# EAGLE design Node_Board (EAGLE 8.6.3)
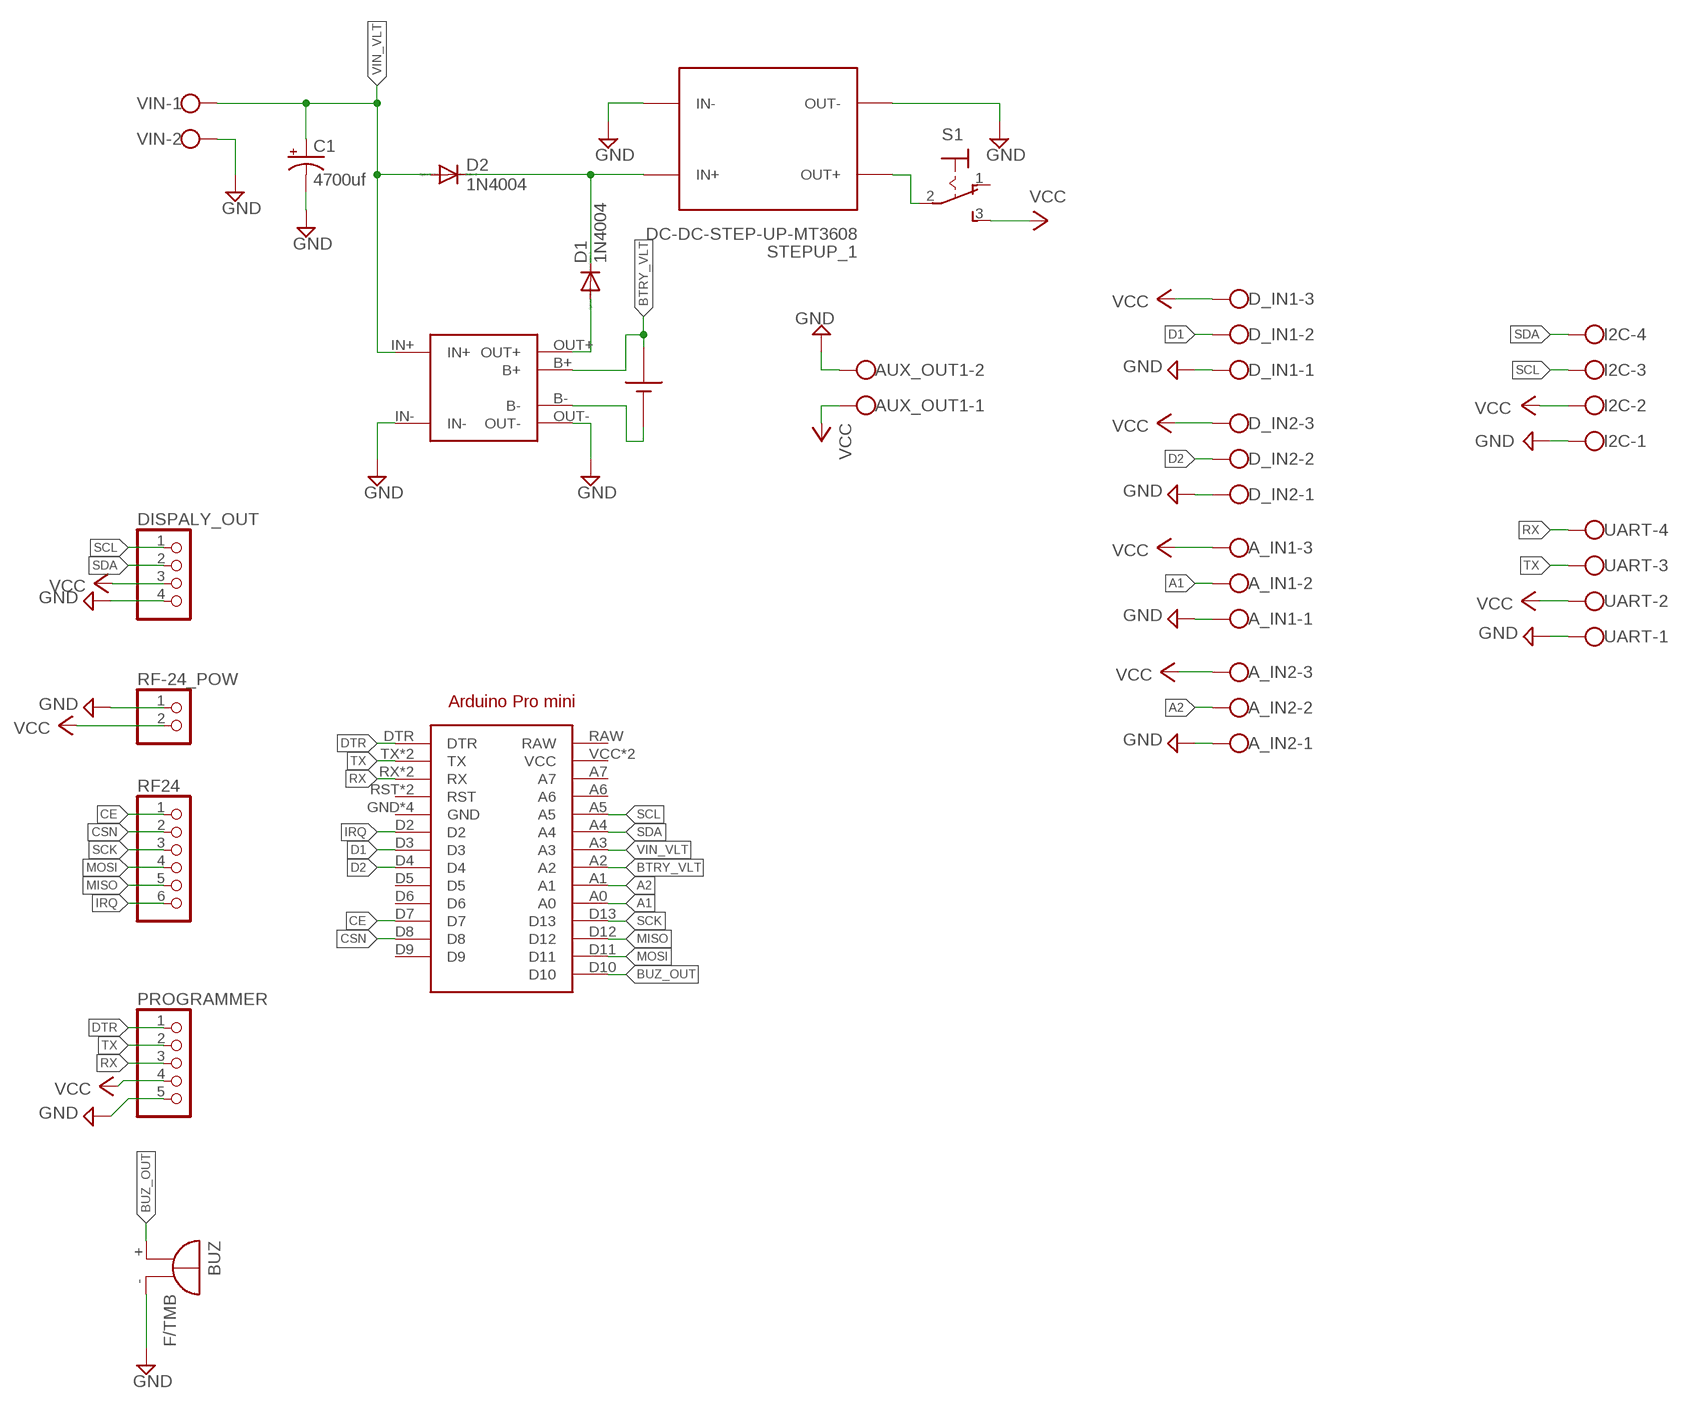
[diagram p0: schematic, sheet 1]

## Parts
A_IN1  W237-103  [W237-103]
A_IN2  W237-103  [W237-103]
ARDUINO1  ARDUINO_PRO_MINI  [ARDUINO_PRO_MINI]
AUX_OUT1  W237-102  [W237-102]
BATTRY  18650CABLE  [18650-CASE-CABLE]
BUZ  F/TMB  [F/TMB]
C1  4700uf  CPOL-USE3.5-8  [E3,5-8]
D1  1N4004  [DO41-10]
D2  1N4004  [DO41-10]
D_IN1  W237-103  [W237-103]
D_IN2  W237-103  [W237-103]
DISPALY_OUT  PINHD-1X4  [1X04]
I2C  W237-4  [W237-4]
PROGRAMMER  PINHD-1X5  [1X05]
RF24  PINHD-1X6  [1X06]
RF-24_POW  PINHD-1X2  [1X02]
S1  M9040P  [M9040P]
STEPUP_1  DC-DC-STEP-UP-MT3608  [DC-DC-STEP-UP-MT3608]
U$2  TP4056-MODULE  [TP4056-LITHIUM-PROTECTED-MODULE]
UART  W237-4  [W237-4]
VIN  W237-102  [W237-102]

## Nets
A1: A_IN1.2 ARDUINO1.A0
A2: A_IN2.2 ARDUINO1.A1
BTRY_VLT: ARDUINO1.A2 BATTRY.POS U$2.B+
BUZ_OUT: ARDUINO1.D10 BUZ.+
CE: ARDUINO1.D7 RF24.1
CSN: ARDUINO1.D8 RF24.2
D1: ARDUINO1.D3 D_IN1.2
D2: ARDUINO1.D4 D_IN2.2
DTR: ARDUINO1.DTR PROGRAMMER.1
GND: A_IN1.1 A_IN2.1 AUX_OUT1.2 BUZ.- C1.- D_IN1.1 D_IN2.1 DISPALY_OUT.4 I2C.1 PROGRAMMER.5 RF-24_POW.1 STEPUP_1.IN- STEPUP_1.OUT- U$2.IN- U$2.OUT- UART.1 VIN.2
IRQ: ARDUINO1.D2 RF24.6
MISO: ARDUINO1.D12 RF24.5
MOSI: ARDUINO1.D11 RF24.4
N$1: D1.C D2.C STEPUP_1.IN+
N$2: BATTRY.NEG U$2.B-
N$3: D1.A U$2.OUT+
N$4: S1.2(P) STEPUP_1.OUT+
RX: ARDUINO1.RX ARDUINO1.RX@1(RX) PROGRAMMER.3 UART.4
SCK: ARDUINO1.D13 RF24.3
SCL: ARDUINO1.A5 DISPALY_OUT.1 I2C.3
SDA: ARDUINO1.A4 DISPALY_OUT.2 I2C.4
TX: ARDUINO1.TX ARDUINO1.TX@1(TX) PROGRAMMER.2 UART.3
VCC: A_IN1.3 A_IN2.3 AUX_OUT1.1 D_IN1.3 D_IN2.3 DISPALY_OUT.3 I2C.2 PROGRAMMER.4 RF-24_POW.2 S1.3(S) UART.2
VIN_VLT: ARDUINO1.A3 C1.+ D2.A U$2.IN+ VIN.1
Unconnected: ARDUINO1.A6 ARDUINO1.A7 ARDUINO1.D5 ARDUINO1.D6 ARDUINO1.D9 ARDUINO1.RAW ARDUINO1.RST ARDUINO1.RST@1(RST) S1.1(O)

## Power pins joined to a net without a drawn wire
GND: ARDUINO1.GND ARDUINO1.GND@1(GND) ARDUINO1.GND@2(GND) ARDUINO1.GND@3(GND)
VCC: ARDUINO1.VCC ARDUINO1.VCC@1(VCC)

## Library data of the parts
A_IN1 A_IN2 D_IN1 D_IN2 = con-wago-500:W237-103: WAGO SCREW CLAMP; MPN: 237-103; OC_FARNELL: unknown; OC_NEWARK: 18M7116
ARDUINO1 = arduinopromini:ARDUINO_PRO_MINI: For creating Arduino Pro Mini shields
AUX_OUT1 VIN = con-wago-500:W237-102: WAGO SCREW CLAMP; MPN: 237-102; OC_FARNELL: unknown; OC_NEWARK: 70K9898
BATTRY = userlib:18650: Lithium Ion 18650
BUZ = buzzer:F/TMB: BUZZER Source: Buerklin; OC_FARNELL: unknown; OC_NEWARK: unknown
C1 = adafruit:CPOL-US: POLARIZED CAPACITOR, American symbol
D1 D2 = diode:1N4004: DIODE general purpose rectifier, 1 A
DISPALY_OUT = pinhead:PINHD-1X4: PIN HEADER
I2C UART = con-wago-500:W237-4: WAGO SCREW CLAMP; OC_FARNELL: unknown; OC_NEWARK: unknown
PROGRAMMER = pinhead:PINHD-1X5: PIN HEADER
RF24 = pinhead:PINHD-1X6: PIN HEADER
RF-24_POW = pinhead:PINHD-1X2: PIN HEADER
S1 = switch:M9040P: TOGGLE SWITCH Marquardt
STEPUP_1 = diy-modules:DC-DC-STEP-UP-MT3608: DC/DC Step-Up Regulator based on MT3608 chip MT3608 datasheet available here: https://www.olimex.com/Products/Breadboarding/BB-PWR-3608/resources/MT3608.pdf Click here to find device on ebay.com <http://www.ebay.com/sch/mt3608+module>
U$2 = userlib:TP4056-MODULE

## Board
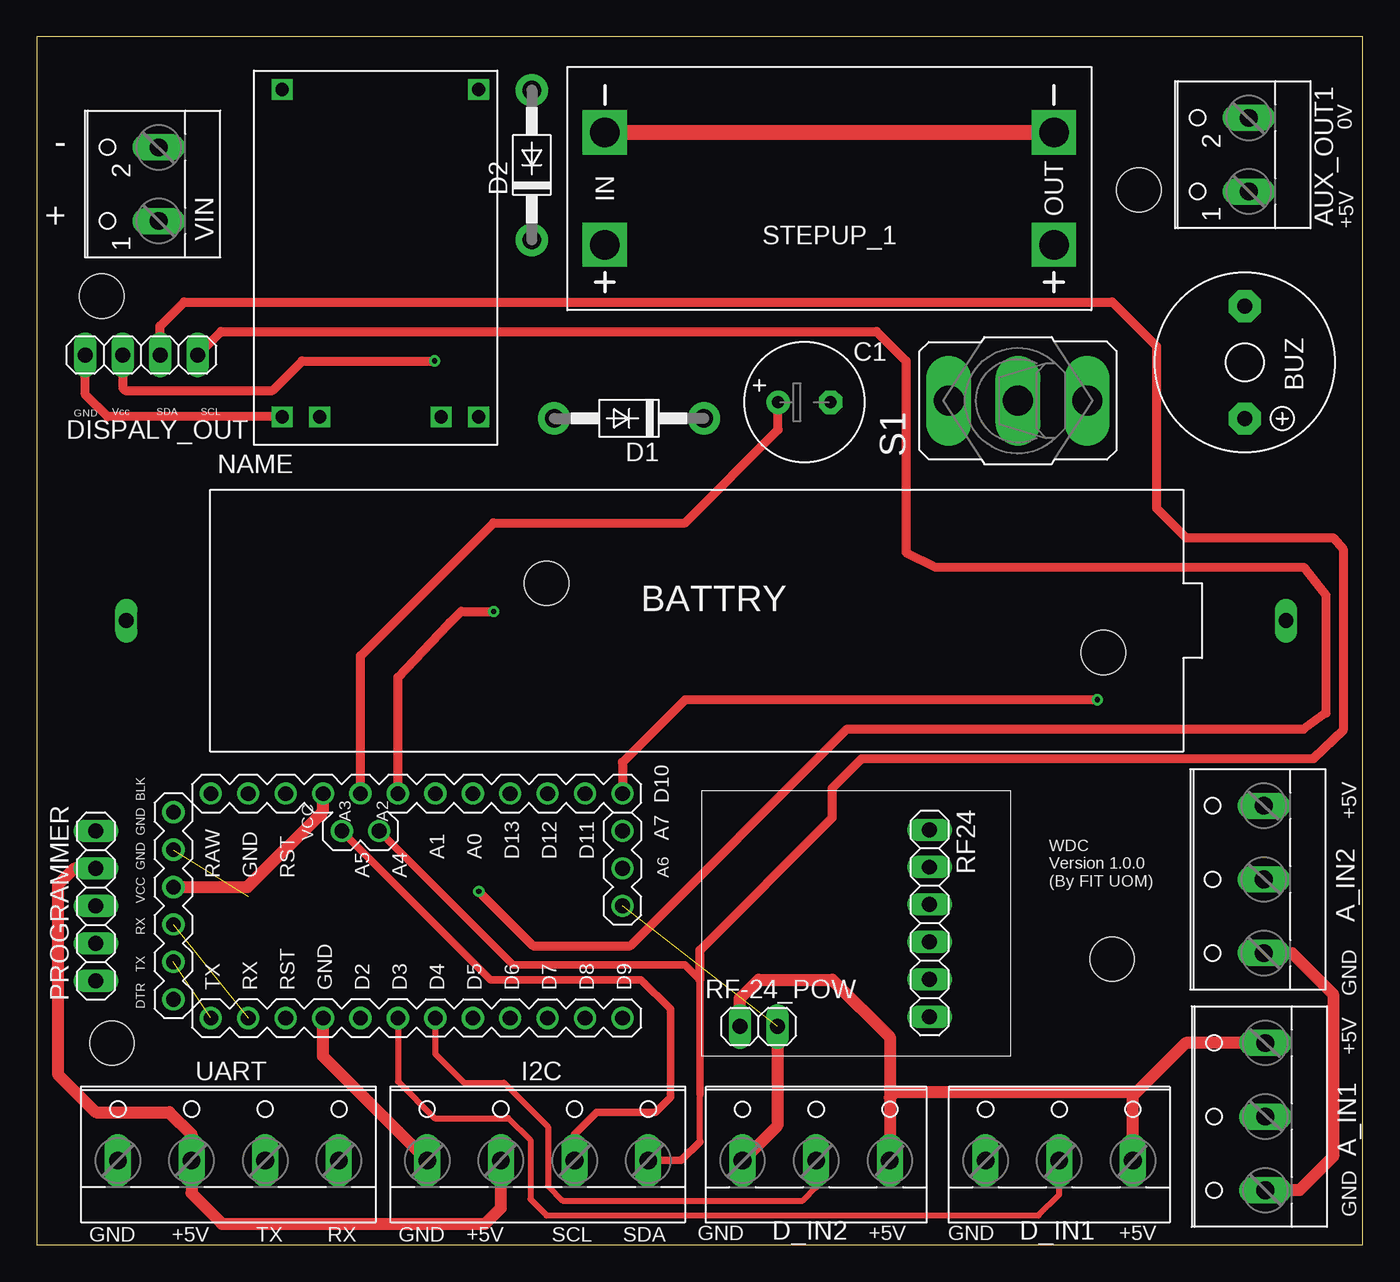
[diagram p1: board, top side]
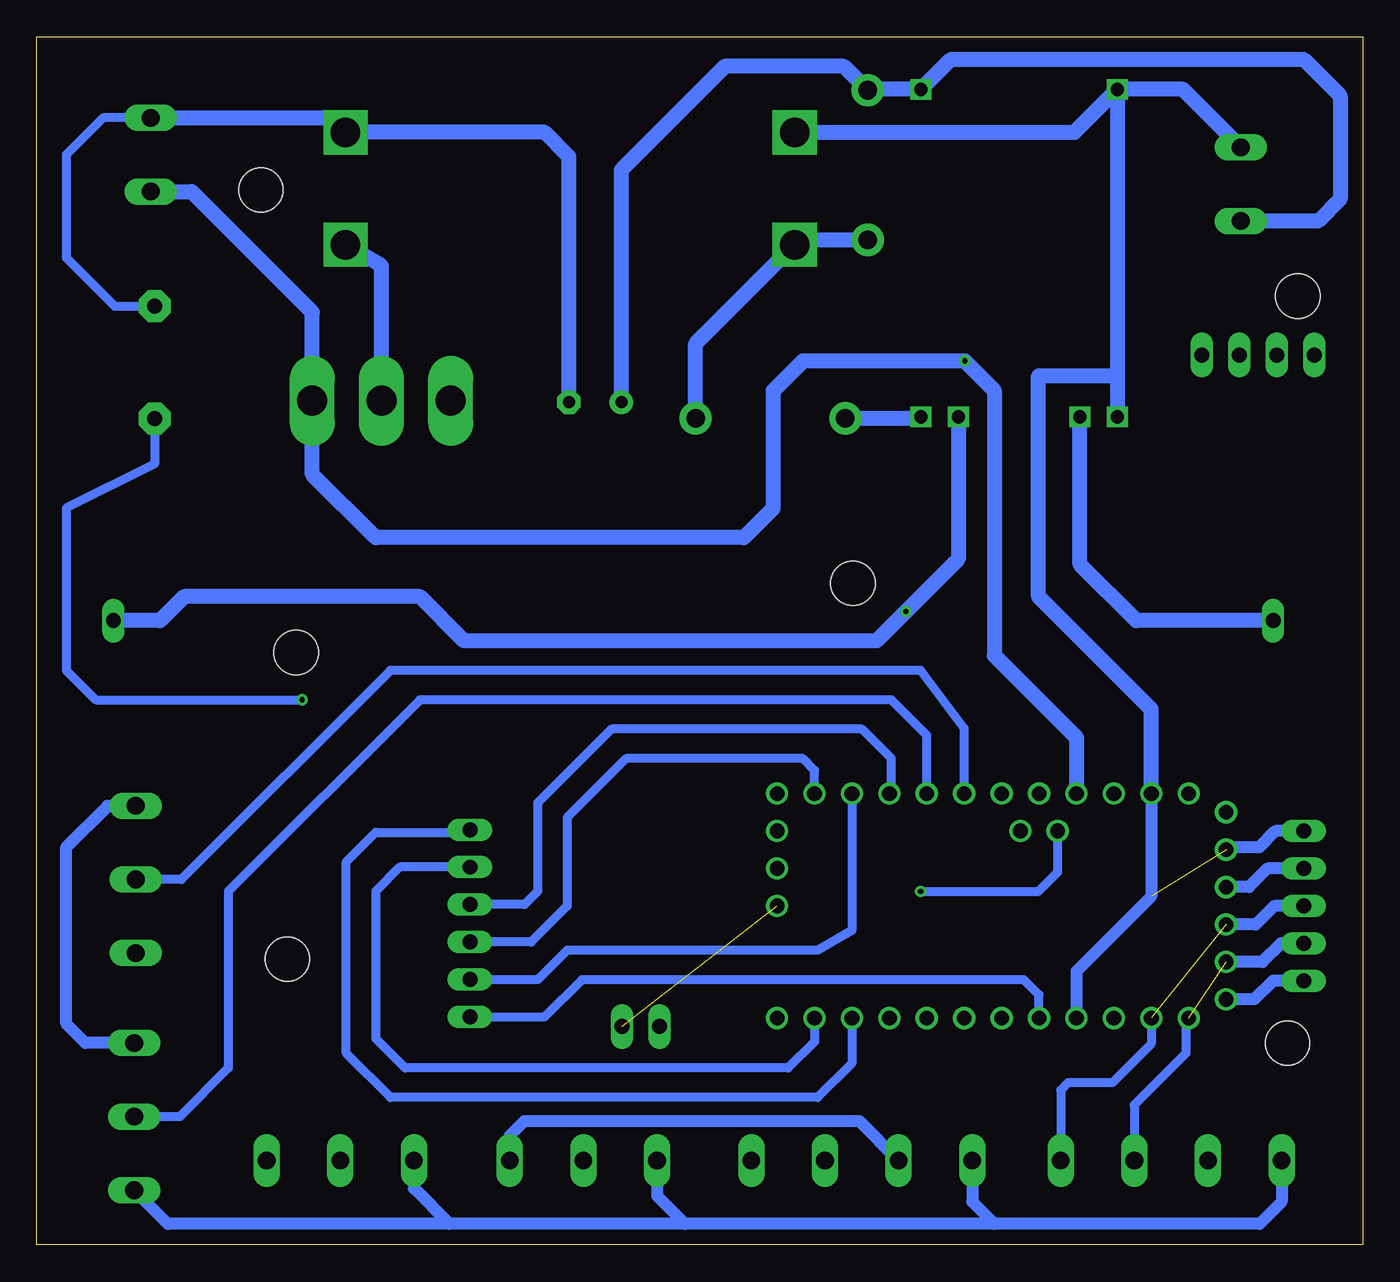
[diagram p2: board, bottom side, seen from below]

Size 90 x 82 mm. Coordinates in mm from the lower left corner, seen from the top.
Outline: 0,0 90,0 90,82 0,82 0,0
Copper layers (1*16): Top 0.035mm / dielectric 1.5mm / Bottom 0.035mm
Design rules "default": minimum track width 6mil, minimum drill 0.35mm, track to track 6mil, track to pad 6mil, pad to pad 6mil, via to via 6mil, smd to smd 6mil, copper to edge 40mil, drill to drill 6mil, minimum pad ring 10mil, minimum via ring 8mil, stop-mask expansion 4mil, vias tented up to drill 0mil, thermal gap 10mil
Holes 3 mm at 72.4,40.2 34.6,44.9 73,19.4 74.8,71.6 4.4,64.4 5.1,13.7

### Footprints (pad centres in the part's own frame; a part is rotated, then mirrored left to right if it is on the bottom)
W237-103 = drill 1.194 long: 1 -5,-1.29; 2 0,-1.29; 3 5,-1.29
ARDUINO_PRO_MINI = drill 1: A0 11.43,-8.89; A1 11.43,-6.35; A2 11.43,-3.81; A3 11.43,-1.27; A4 8.89,-2.54; A5 8.89,0; A6 6.35,-19.05; A7 8.89,-19.05; BLK 10.16,11.43; D2 -3.81,-1.27; D3 -3.81,-3.81; D4 -3.81,-6.35; D5 -3.81,-8.89; D6 -3.81,-11.43; D7 -3.81,-13.97; D8 -3.81,-16.51; D9 -3.81,-19.05; D10 11.43,-19.05; D11 11.43,-16.51; D12 11.43,-13.97; D13 11.43,-11.43; DTR -2.54,11.43; GND -3.81,1.27; GND@1 11.43,6.35; GND@2 7.62,11.43; GND@3 3.81,-19.05; RAW 11.43,8.89; RST 11.43,3.81; RST@1 -3.81,3.81; RX -3.81,6.35; RX@1 2.54,11.43; TX -3.81,8.89; TX@1 0,11.43; VCC 11.43,1.27; VCC@1 5.08,11.43
W237-102 = drill 1.194 long: 1 -2.5,-1.27; 2 2.5,-1.27
18650-CASE-CABLE = drill 1 pad 1.5 long: NEG -38.73,0; POS 40,0
F/TMB = drill 1.016 pad 2.159 octagon: + 3.81,0; - -3.81,0
E3,5-8 = drill 0.813 pad 1.6: + -1.778,0 | drill 0.813 pad 1.6 octagon: - 1.778,0
DO41-10 = drill 1.27 pad 2.184: A 5.08,0; C -5.08,0
1X04 = drill 1.016 long: 1 -3.81,0; 2 -1.27,0; 3 1.27,0; 4 3.81,0
W237-4 = drill 1.194 long: 1 -7.5,-1.27; 2 -2.5,-1.27; 3 2.5,-1.27; 4 7.5,-1.27
1X05 = drill 1.016 long: 1 -5.08,0; 2 -2.54,0; 3 0,0; 4 2.54,0; 5 5.08,0
1X06 = drill 1.016 long: 1 -6.35,0; 2 -3.81,0; 3 -1.27,0; 4 1.27,0; 5 3.81,0; 6 6.35,0
1X02 = drill 1.016 long: 1 -1.27,0; 2 1.27,0
M9040P = drill 2.032 long: 1 0,4.699; 2 0,0; 3 0,-4.699
DC-DC-STEP-UP-MT3608 = drill 2 pad 2.8 square: IN+ 15.24,3.81; IN- 15.24,-3.81; OUT+ -15.24,3.81; OUT- -15.24,-3.81
TP4056-LITHIUM-PROTECTED-MODULE = drill 0.9 square: B+ 10.795,4.445; B- 10.795,-3.81; IN+ -11.43,6.985; IN- -11.43,-6.35; OUT+ 10.795,6.985; OUT- 10.795,-6.35

### Placement (x,y rotation side)
A_IN1  82.1,8.7 90 top
A_IN2  82,24.8 90 top
ARDUINO1  20.7,19.2 90 top
AUX_OUT1  81,74 90 top
BATTRY  44.8,42.37 0 top
BUZ  82,59.9 270 top
C1  52.1,57.2 0 top
D1  40.2,56.1 180 top
D2  33.6,73.3 90 top
D_IN1  69.4,7 0 top
D_IN2  52.9,7 0 top
DISPALY_OUT  7.1,60.4 180 top
I2C  34,7 0 top
PROGRAMMER  4,23 90 top
RF24  60.61,21.82 270 top
RF-24_POW  49,14.82 180 top
S1  66.6,57.3 90 top
STEPUP_1  53.8,71.7 180 top
U$2  23,67 270 top
UART  13,7 0 top
VIN  7,72 90 top

### Tracks (layer width: path | path; a pad name or v marks a point on that pad's centre or on a via)
A1
  Bottom 0.61: ARDUINO1.A0 29.59,34.59 32,37 64,37 77,24 77,12 80.3,8.7 A_IN1.2
A2
  Bottom 0.61: ARDUINO1.A1 27.05,35.05 30,39 66,39 80.2,24.8 A_IN2.2
BTRY_VLT  (via drill 0.35)
  Top 0.61: ARDUINO1.A2 24.51,38.51 27.9,42.09 | 27.9,42.09 28.1,42.3 | 27.9,42.09 28.81,43 v31,43
  Bottom 1.016: U$2.B+ 27.45,46.55 v31,43 33,41 61,41 64,44 80,44 81.63,42.37 BATTRY.POS
BUZ_OUT  (via drill 0.35)
  Top 0.61: v72,37 44,37 39.75,32.75 ARDUINO1.D10
  Bottom 0.61: BUZ.+ 82,53 88,50 88,39 86,37 v72,37
CE
  Bottom 0.61: ARDUINO1.D7 34.67,12.33 37,10 66,10 69,13 69,26 67,28 60.78,28 RF24.1
CSN
  Bottom 0.61: ARDUINO1.D8 37.21,13.79 39,12 65,12 67,14 67,24 65.37,25.63 RF24.2
D1
  Top 0.406: ARDUINO1.D3 24.51,11.09 27,8.6 32,8.6 33.5,7.1 33.5,3.1 34.6,2 68,2 69.4,3.4 D_IN1.2
D2
  Top 0.406: ARDUINO1.D4 27.05,12.95 29,11 31.7,11 34.7,8 34.7,4 35.7,3 52,3 52.9,3.9 D_IN2.2
DTR
  Bottom 0.813: PROGRAMMER.1 6.08,17.92 7.34,16.66 ARDUINO1.DTR
GND  (2 unrouted)
  Top 0.61: U$2.OUT- 4.79,56.2 3.29,57.71 DISPALY_OUT.4
  Top 0.813: A_IN2.1 85.2,19.8 88,17 88,6 85.7,3.7 A_IN1.1 | I2C.1 19.43,12.8 ARDUINO1.GND | RF-24_POW.1 50.27,8.08 D_IN2.1
  Top 1.016: STEPUP_1.IN- STEPUP_1.OUT-
  Bottom 0.61: AUX_OUT1.2 85.5,76.5 88,74 88,67 84.71,63.71 BUZ.-
  Bottom 0.813: PROGRAMMER.5 5.92,28.08 7,27 9.09,27 ARDUINO1.GND@2 | A_IN1.1 81.11,1.42 62,1.42 | UART.1 5.5,2.92 7,1.42 25,1.42 | ARDUINO1.GND@1 14.35,23.65 19.43,18.57 ARDUINO1.GND | 25,1.42 46,1.42 | 46,1.42 62,1.42 | D_IN2.1 47.9,3.32 46,1.42 | D_IN1.1 64.4,3.82 62,1.42 | I2C.1 26.5,2.92 25,1.42
  Bottom 1.016: U$2.IN- 19.57,75.51 STEPUP_1.IN- | VIN.2 12.2,78.43 U$2.IN- | U$2.IN- 16.65,59 | 16.65,59 U$2.OUT- | AUX_OUT1.2 69.03,76.5 STEPUP_1.OUT- 55.51,75.51 53.88,73.88 C1.- | ARDUINO1.GND@1 14.35,36.35 22,44 22,59 16.65,59
IRQ
  Bottom 0.61: RF24.6 55.53,15.47 53,18 23,18 21.97,16.97 ARDUINO1.D2
MISO
  Bottom 0.61: ARDUINO1.D12 34.67,21.33 37,20 54,20 56,18 60.59,18 RF24.5
MOSI
  Bottom 0.61: ARDUINO1.D11 37.21,32.21 38,33 50,33 54,29 54,23 56.45,20.55 RF24.4
N$1
  Bottom 1.016: D2.C 38.23,68.22 STEPUP_1.IN+ 45.28,61.17 D1.C
N$2
  Bottom 1.016: BATTRY.NEG 15.37,42.37 19.19,46.19 U$2.B-
N$3
  Bottom 1.016: U$2.OUT+ 30.09,56.1 D1.A
N$4
  Bottom 1.016: S1.2 66.6,66.45 STEPUP_1.OUT+
RX  (1 unrouted)
  Bottom 0.61: ARDUINO1.RX 14.35,13.65 17,11 20,11 20.5,10.5 UART.4
  Bottom 0.813: PROGRAMMER.3 6,23 7.26,21.74 ARDUINO1.RX@1
SCK
  Bottom 0.61: ARDUINO1.D13 32,30.76 32,33 34,35 51,35 56,30 56,24 56.91,23.09 RF24.3
SCL  (via drill 0.35)
  Top 0.508: ARDUINO1.A5 30.79,18 41,18 43,16 43,10 42,9 38,9 36.5,7.5 I2C.3
  Top 0.61: DISPALY_OUT.1 12.51,62 57,62 59,60 59,47 61,46 86,46 87.5,44.1 87.5,36.1 86,35 55,35 40.3,20.3 33.7,20.3 v30,24
  Bottom 0.61: v30,24 22,24 20.7,25.3 ARDUINO1.A5
SDA
  Top 0.406: 45,7 45,10.23
  Top 0.508: ARDUINO1.A4 32.33,19 44,19 45,18 45,10.23 | I2C.4 43.73,5.73 45,7
  Top 0.61: DISPALY_OUT.2 8.37,62.37 10,64 73,64 76,61 76,50 78,48 88,48 88.68,47.22 88.68,34.9 86.68,33 56,33 54,31 54,29 45,20 45,18
TX  (1 unrouted)
  Bottom 0.406: ARDUINO1.TX 12,15.2
  Bottom 0.61: 12,15.2 12,13 15.5,9.5 UART.3
  Bottom 0.813: PROGRAMMER.2 5.54,20.46 6.8,19.2 ARDUINO1.TX@1
VCC  (via drill 0.35)
  Top 0.61: DISPALY_OUT.3 5.83,58.17 6,58 16,58 18,60 v27,60
  Top 0.813: A_IN1.3 78,13.7 74.65,10.35 | D_IN1.3 74.4,10.1 74.65,10.35 | I2C.2 31.5,2.5 30.42,1.42 12.58,1.42 10.5,3.5 UART.2 10.5,7.5 9,9 4,9 1.42,11.58 1.42,24.42 2.54,25.54 PROGRAMMER.4 | ARDUINO1.VCC@1 14.28,24.28 19.43,29.43 ARDUINO1.VCC | RF-24_POW.2 47.73,16.73 49,18 54,18 57.9,14.1 57.9,10 | 57.9,10 D_IN2.3 | 74.65,10.35 58.25,10.35 57.9,10
  Bottom 0.813: PROGRAMMER.4 6.46,25.54 7.72,24.28 ARDUINO1.VCC@1 | A_IN2.3 85.2,29.8 88,27 88,15 86.7,13.7 A_IN1.3 | D_IN2.3 57.9,7.4 56.9,8.4 34.17,8.4 I2C.2
  Bottom 1.016: AUX_OUT1.1 79.5,71.5 71.3,63.3 S1.3 71.3,52.3 67,48 42,48 40,50 40,58 38,60 v27,60 25,58 25,40 19.43,34.43 ARDUINO1.VCC
VIN_VLT
  Top 0.61: ARDUINO1.A3 21.97,39.97 31,49 44,49 50.32,55.32 C1.+
  Bottom 1.016: VIN.1 3.02,69.5 1.52,71 1.52,78 4,80.48 27.94,80.48 U$2.IN+ 33.55,78.43 D2.A 35.22,80 43.3,80 50.15,73.15 50.3,73 50.32,72.98 C1.+

### Text on the board
tNames: 0V | - | + | +5V | GND | Vcc | SDA | SCL | BATTRY | +5V | WDC / Version 1.0.0 / (By FIT UOM) | GND | +5V | GND | GND | +5V | TX | RX | GND | +5V | SCL | SDA | GND | +5V | GND | +5V